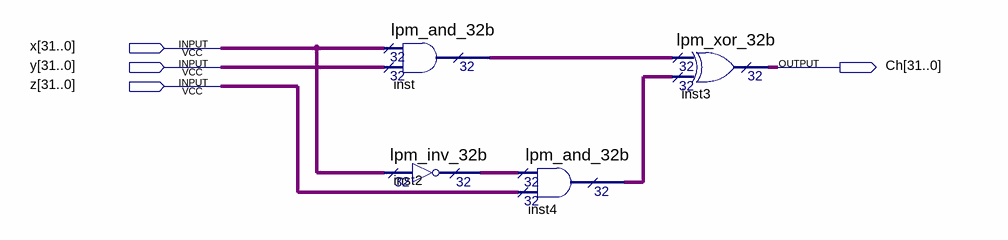
[diagram p0: schematic sheet]
// Quartus schematic Ch.bdf as structural Verilog: 4 symbols, 4 pins
module Ch (
  input  [31:0] x,
  input  [31:0] y,
  input  [31:0] z,
  output [31:0] Ch
);

  wire [31:0] inst2_result, inst4_result, inst_result;

  lpm_and_32b inst (.data0x(x), .data1x(y), .result(inst_result));
  lpm_inv_32b inst2 (.data(x), .result(inst2_result));
  lpm_and_32b inst4 (.data0x(inst2_result), .data1x(z), .result(inst4_result));
  lpm_xor_32b inst3 (.data0x(inst_result), .data1x(inst4_result), .result(Ch));
endmodule
